# Altium schematic sheet Unused_Modem_Pins.SchDoc: Unused Modem Pins
size 292 x 193 mm; SheetNumber: 9; SheetTotal: 9
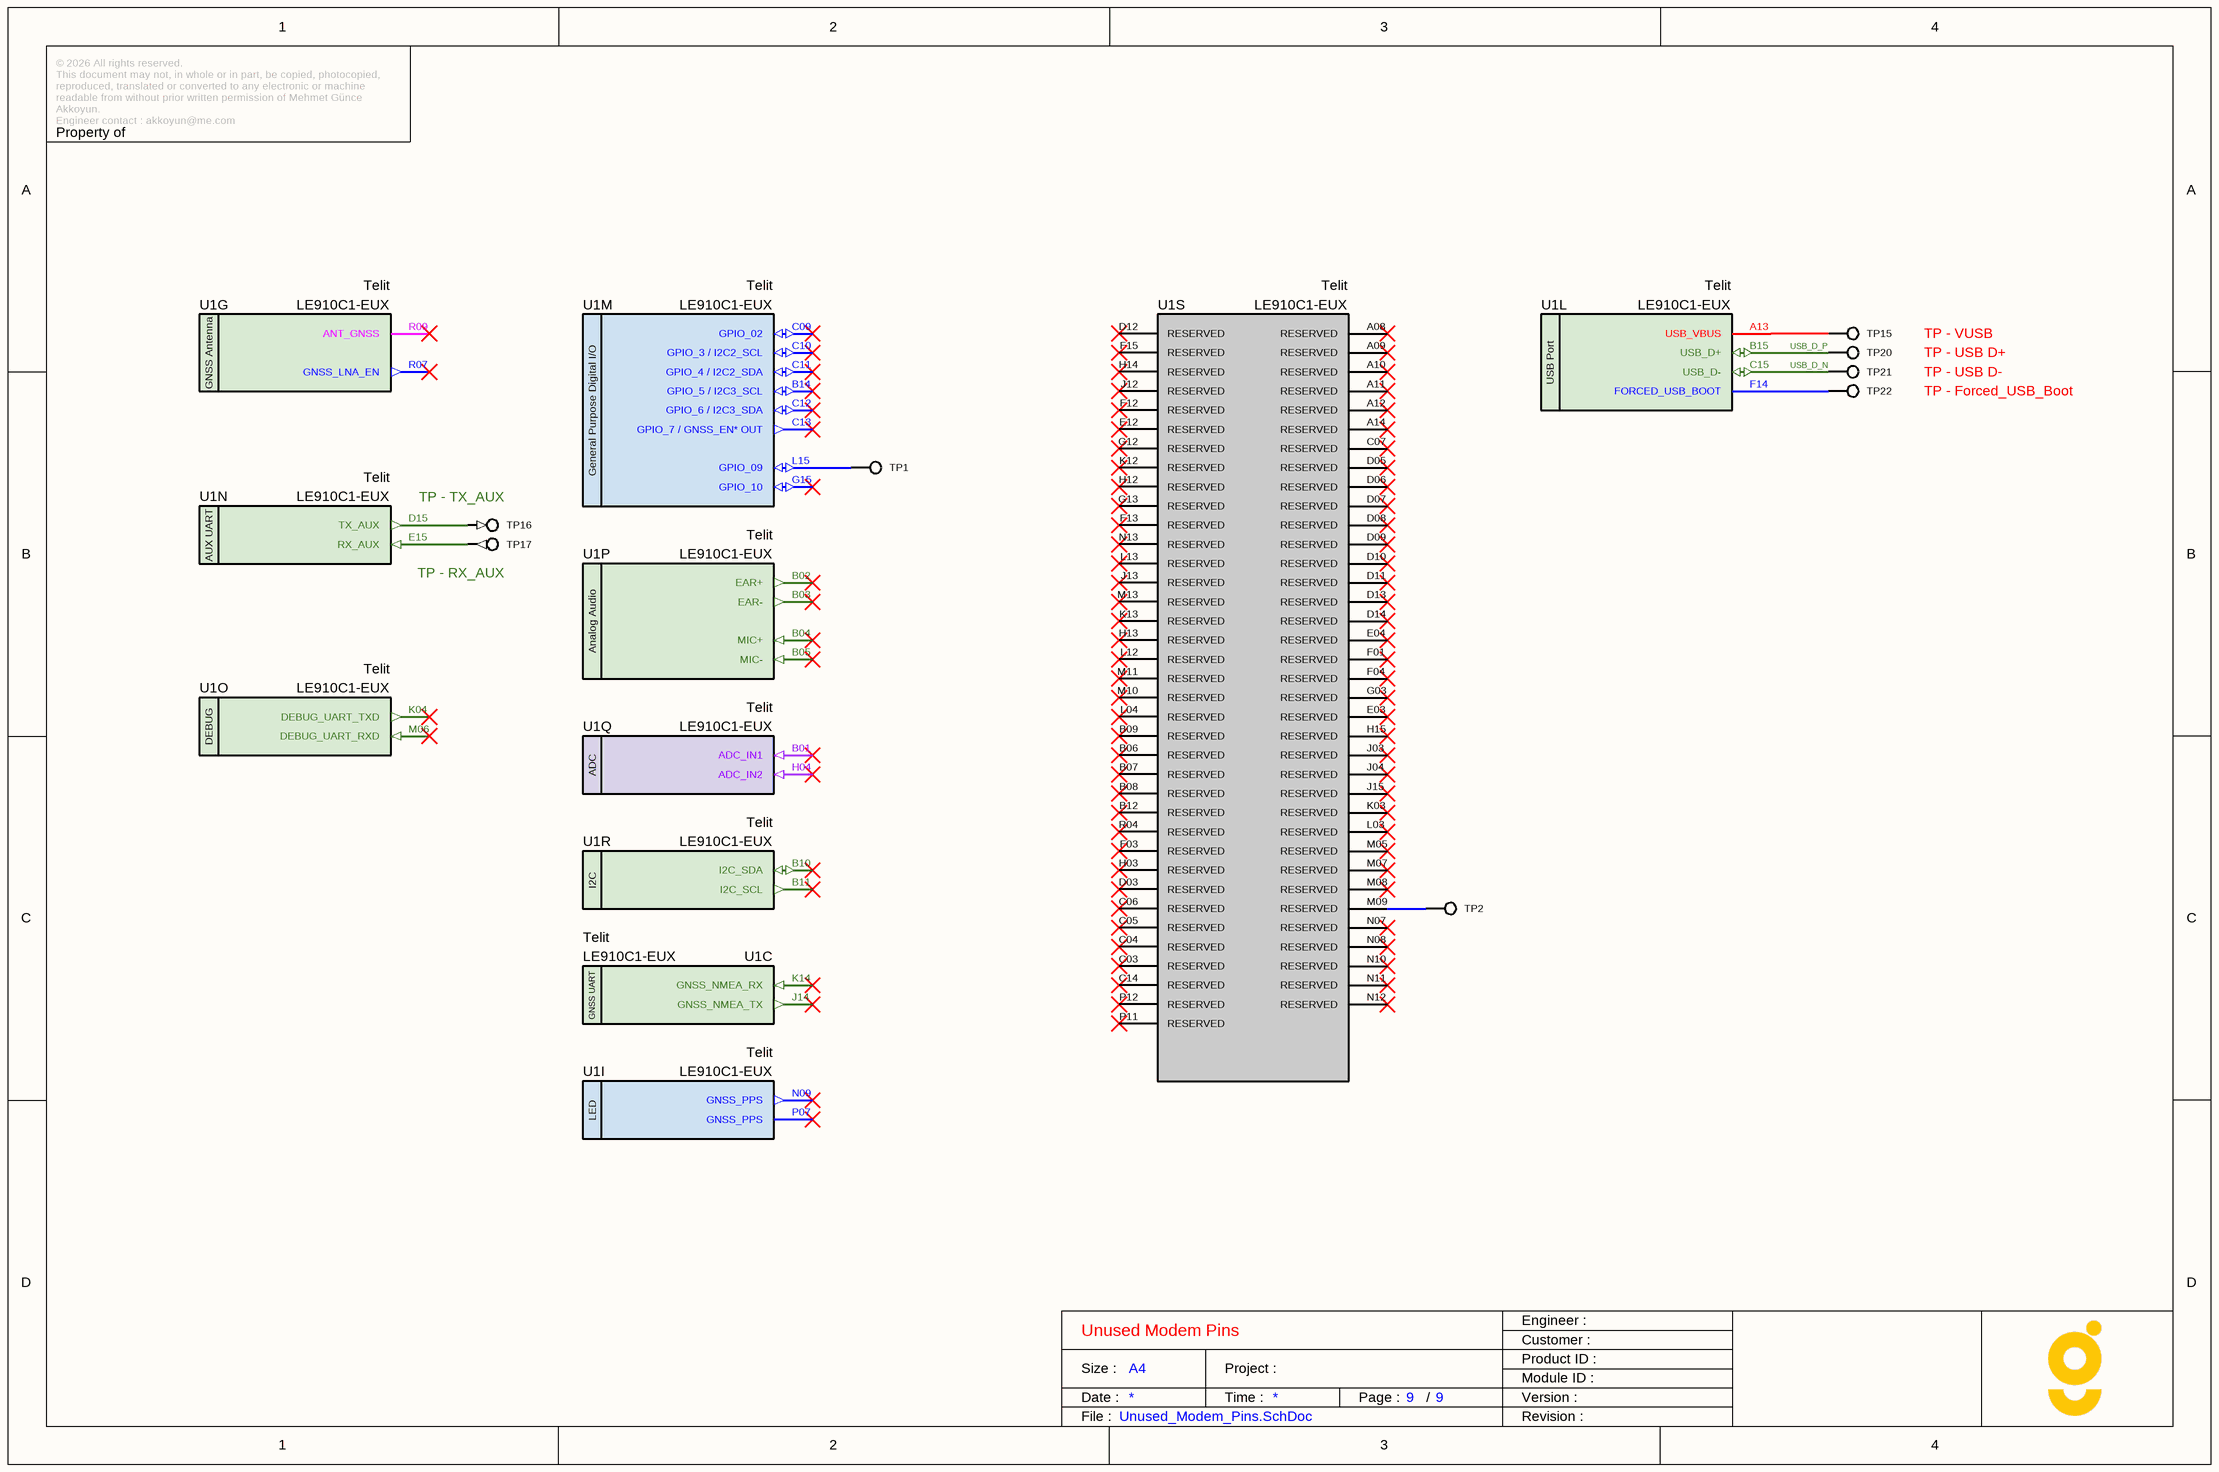
[diagram p0: Unused_Modem_Pins.SchDoc]

## Parts
TP1  PCB - Test Point  [TP]  (value not drawn)  (no BOM)
TP2  PCB - Test Point  [TP]  (value not drawn)  (no BOM)
TP15  TP - VUSB  [TP]  (no BOM)
TP16  TP - TX_AUX  [TP]  (no BOM)
TP17  TP - RX_AUX  [TP]  (no BOM)
TP20  TP - USB D+  [TP]  (no BOM)
TP21  TP - USB D-  [TP]  (no BOM)
TP22  TP - Forced_USB_Boot  [TP]  (no BOM)
U1  Manufacturer Part Number: LE910C1-EUX  Manufacturer Name: Telit  [LE910 GSM Modem]  (hidden comment: LE910C1-EUX LTE GSM Module)  (parts C,G,I,L,M,N,O,P,Q,R,S of 19)

## Nets
USB_D_N: TP21.1 U1.C15(USB_D-)
USB_D_P: TP20.1 U1.B15(USB_D+)
NetTP1_1: TP1.1 U1.L15(GPIO_09)
NetTP2_1: TP2.1 U1.M09(RESERVED)
NetTP15_1: TP15.1 U1.A13(USB_VBUS)
NetTP16_1: TP16.1 U1.D15(TX_AUX)
NetTP17_1: TP17.1 U1.E15(RX_AUX)
NetTP22_1: TP22.1 U1.F14(FORCED_USB_BOOT)

Not connected (* = marked no-connect by the designer): U1 A08(RESERVED)* A09(RESERVED)* A10(RESERVED)* A11(RESERVED)* A12(RESERVED)* A14(RESERVED)* B01(ADC_IN1)* B02(EAR+)* B03(EAR-)* B04(MIC+)* B05(MIC-)* B06(RESERVED)* B07(RESERVED)* B08(RESERVED)* B09(RESERVED)* B10(I2C_SDA)* B11(I2C_SCL)* B12(RESERVED)* B14(GPIO_5_/_I2C3_SCL)* C03(RESERVED)* C04(RESERVED)* C05(RESERVED)* C06(RESERVED)* C07(RESERVED)* C09(GPIO_02)* C10(GPIO_3_/_I2C2_SCL)* C11(GPIO_4_/_I2C2_SDA)* C12(GPIO_6_/_I2C3_SDA)* C13(GPIO_7_/_GNSS_EN*_OUT)* C14(RESERVED)* D03(RESERVED)* D05(RESERVED)* D06(RESERVED)* D07(RESERVED)* D08(RESERVED)* D09(RESERVED)* D10(RESERVED)* D11(RESERVED)* D12(RESERVED)* D13(RESERVED)* D14(RESERVED)* E03(RESERVED)* E04(RESERVED)* E12(RESERVED)* F01(RESERVED)* F03(RESERVED)* F04(RESERVED)* F12(RESERVED)* F13(RESERVED)* F15(RESERVED)* G03(RESERVED)* G12(RESERVED)* G13(RESERVED)* G15(GPIO_10)* H03(RESERVED)* H04(ADC_IN2)* H12(RESERVED)* H13(RESERVED)* H14(RESERVED)* H15(RESERVED)* J03(RESERVED)* J04(RESERVED)* J12(RESERVED)* J13(RESERVED)* J14(GNSS_NMEA_TX)* J15(RESERVED)* K03(RESERVED)* K04(DEBUG_UART_TXD)* K12(RESERVED)* K13(RESERVED)* K14(GNSS_NMEA_RX)* L03(RESERVED)* L04(RESERVED)* L12(RESERVED)* L13(RESERVED)* M05(RESERVED)* M06(DEBUG_UART_RXD)* M07(RESERVED)* M08(RESERVED)* M10(RESERVED)* M11(RESERVED)* M13(RESERVED)* N07(RESERVED)* N08(RESERVED)* N09(GNSS_PPS)* N10(RESERVED)* N11(RESERVED)* N12(RESERVED)* N13(RESERVED)* P07(GNSS_PPS)* P11(RESERVED)* P12(RESERVED)* R04(RESERVED)* R07(GNSS_LNA_EN)* R09(ANT_GNSS)*

## Notes on the sheet
- © 2026 All rights reserved.
  This document may not, in whole or in part, be copied, photocopied, reproduced, translated or converted to any electronic or machine readable from without prior written permission of Mehmet Günce Akkoyun.
  Engineer contact : akkoyun@me.com
- Property of
- Engineer :
- Date :
- Size :
- A4
- Time :
- Project :
- Page :
- /
- Customer :
- Product ID :
- Module ID :
- Version :
- File :
- Revision :
- (in symbol IC - LE910C1-EUX, part C) GNSS UART
- (in symbol IC - LE910C1-EUX, part G) GNSS Antenna
- (in symbol IC - LE910C1-EUX, part I) LED
- (in symbol IC - LE910C1-EUX, part L) USB Port
- (in symbol IC - LE910C1-EUX, part M) General Purpose Digital I/O
- (in symbol IC - LE910C1-EUX, part N) AUX UART
- (in symbol IC - LE910C1-EUX, part O) DEBUG
- (in symbol IC - LE910C1-EUX, part P) Analog Audio
- (in symbol IC - LE910C1-EUX, part Q) ADC
- (in symbol IC - LE910C1-EUX, part R) I2C

## Library data of the parts
TP1 TP2 TP15-TP17 TP20-TP22 = PCB - Test Point: Test Point
U1 = IC - LE910C1-EUX: Telit LE910C1-EUX LTE/2G GSM Module; Case: BGA